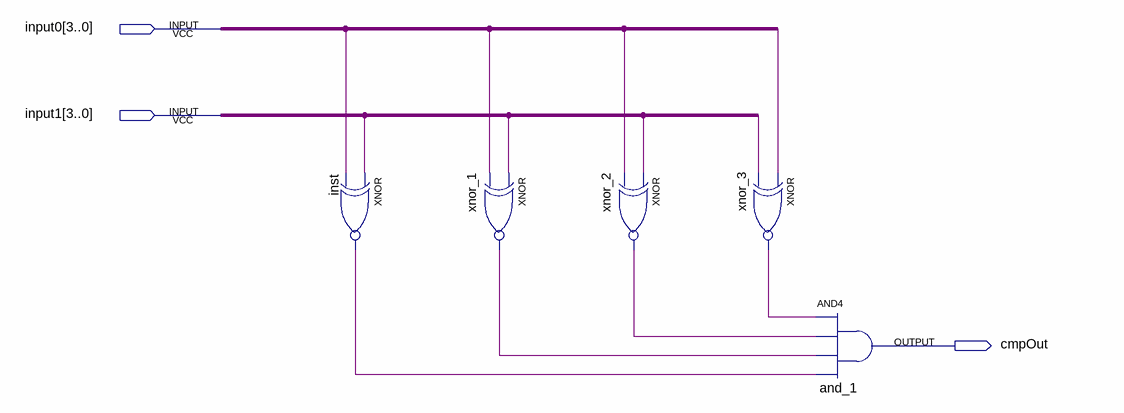
[diagram p0: schematic sheet]
// Quartus schematic EqCmp4.bdf as structural Verilog: 5 symbols, 3 pins
module EqCmp4 (
  input  [3:0] input0,
  input  [3:0] input1,
  output cmpOut
);

  wire inst_out, undriven, undriven_2, undriven_3, undriven_4, undriven_5, undriven_6, undriven_7,
       undriven_8, xnor_1_out, xnor_2_out, xnor_3_out;

  xnor inst (inst_out, undriven, undriven_5);
  xnor xnor_1 (xnor_1_out, undriven_3, undriven_2);
  xnor xnor_2 (xnor_2_out, undriven_8, undriven_4);
  xnor xnor_3 (xnor_3_out, undriven_7, undriven_6);
  and and_1 (cmpOut, xnor_3_out, xnor_2_out, xnor_1_out, inst_out);
endmodule
